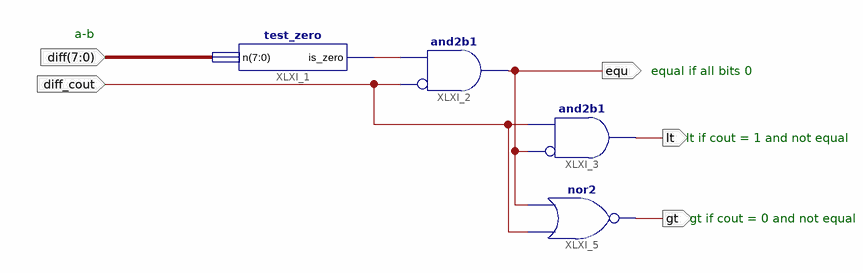
[diagram p0: schematic sheet 1]
// Xilinx ISE schematic cmp_8bit.sch (spartan3e) as structural Verilog: 4 symbols, 5 ports
module cmp_8bit (
  input  [7:0] diff,
  input  diff_cout,
  output equ,
  output lt,
  output gt
);

  wire XLXN_6;

  test_zero XLXI_1 (.n(diff), .is_zero(XLXN_6));
  and XLXI_2 (equ, ~diff_cout, XLXN_6);  // and2b1
  and XLXI_3 (lt, ~equ, diff_cout);  // and2b1
  nor XLXI_5 (gt, diff_cout, equ);

  // Notes on the sheet:
  //   a-b
  //   equal if all bits 0
  //   lt if cout = 1 and not equal
  //   gt if cout = 0 and not equal
endmodule
